# EAGLE design familab_pov (EAGLE 7.1.0)
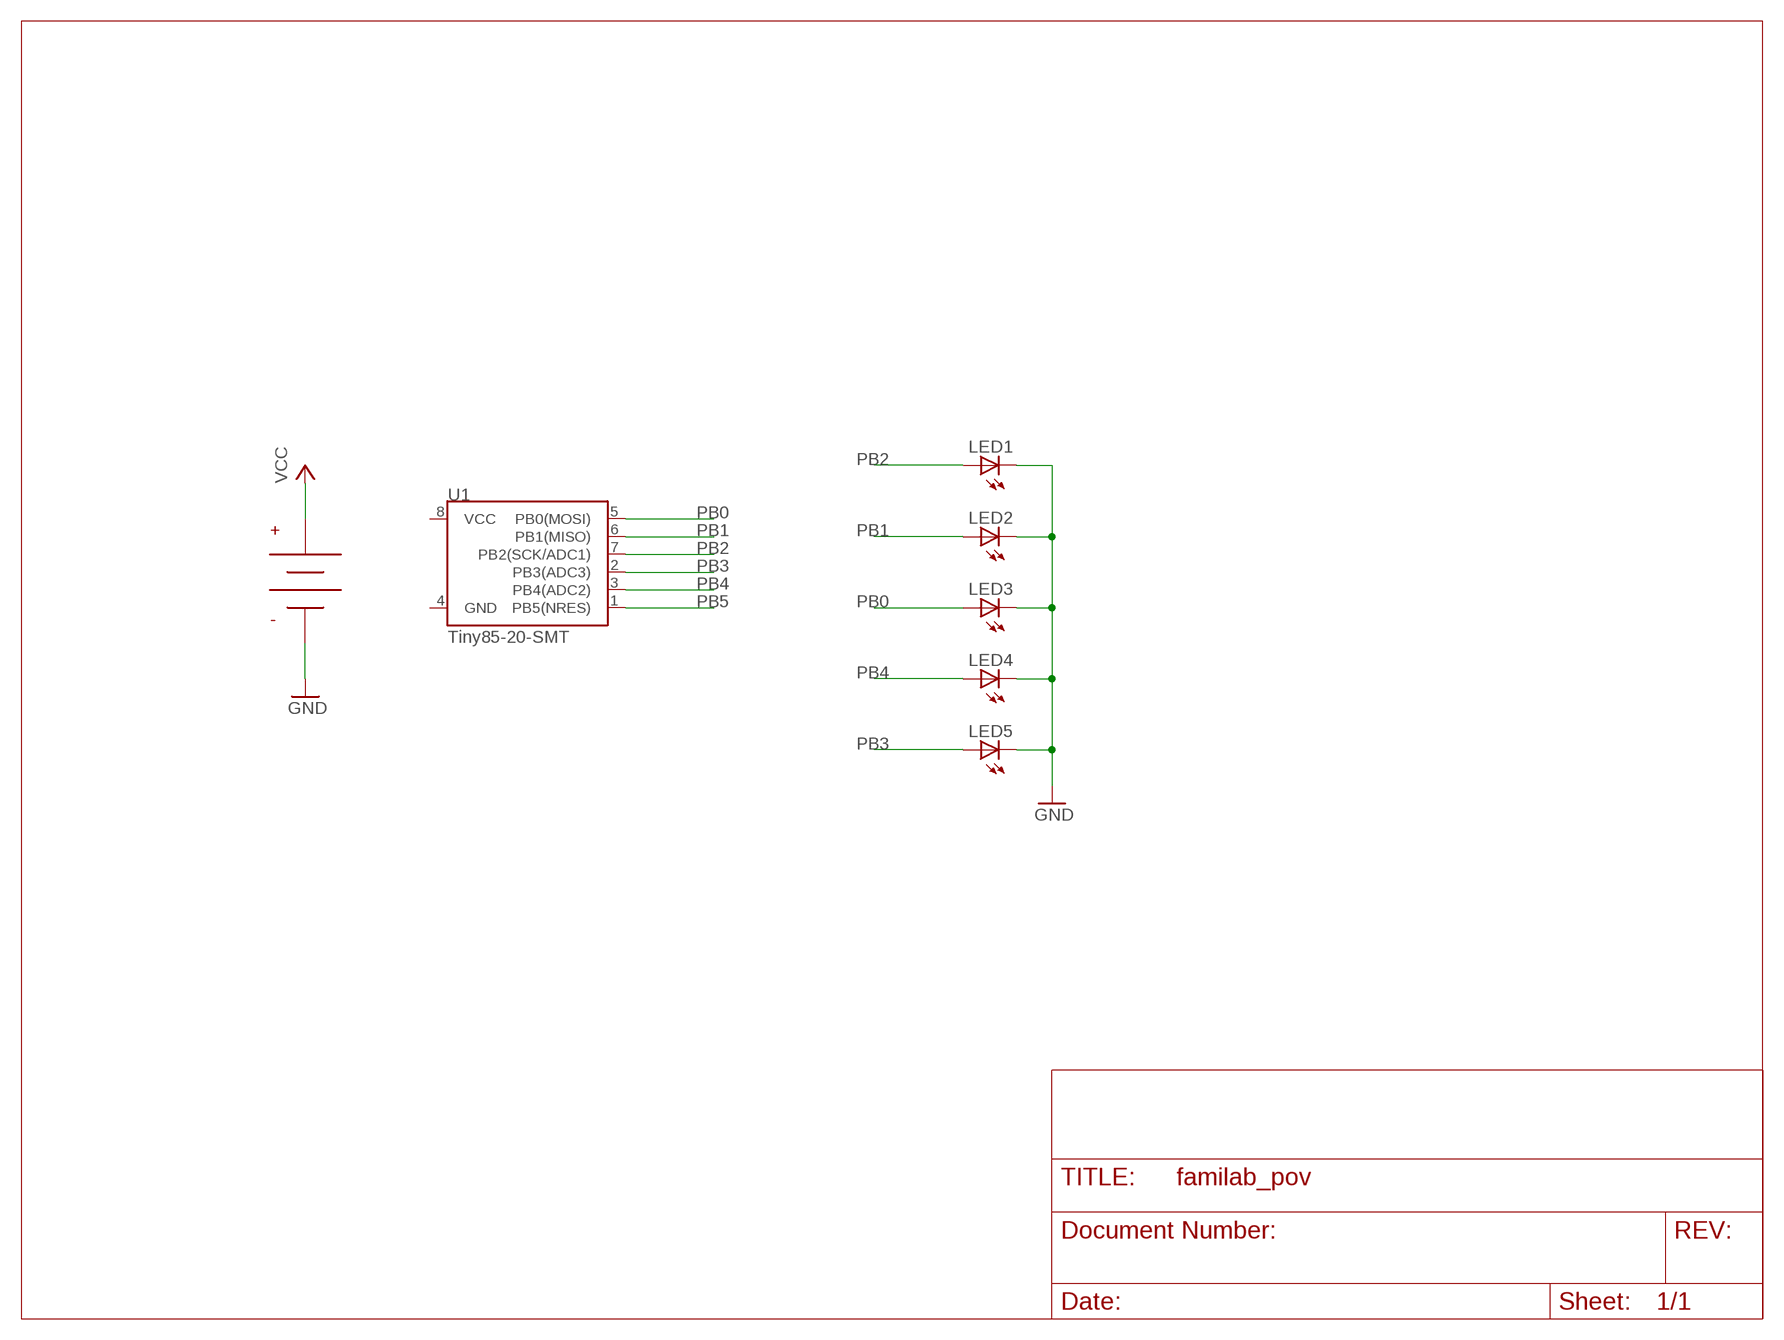
[diagram p0: schematic, sheet 1]

## Parts
LED1  LED  [LED5MM_SMD_SIDE]
LED2  LED  [LED5MM_SMD_SIDE]
LED3  LED  [LED5MM_SMD_SIDE]
LED4  LED  [LED5MM_SMD_SIDE]
LED5  LED  [LED5MM_SMD_SIDE]
U1  Tiny85-20-SMT  ATTINY45TINY85-20-SMT  [SO08-EIAJ]
U$1  CR2032_HOLDER  [CR2032_BC2032-F1]

## Nets
GND: LED1.C LED2.C LED3.C LED4.C LED5.C U$1.NEG
PB0: LED3.A U1.5(PB0(MOSI))
PB1: LED2.A U1.6(PB1(MISO))
PB2: LED1.A U1.7(PB2(SCK/ADC1))
PB3: LED5.A U1.2(PB3(ADC3))
PB4: LED4.A U1.3(PB4(ADC2))
PB5: U1.1(PB5(NRES))
VCC: U$1.POS
Unconnected: U1.4(GND) U1.8(VCC)

## Library data of the parts
LED1-LED5 = led:LED: LED OSRAM: - CHIPLED LG R971, LG N971, LY N971, LG Q971, LY Q971, LO R971, LY R971 LH N974, LH R974 LS Q976, LO Q976, LY Q976 LO Q996 - Hyper CHIPLED LW Q18S LB Q993, LB Q99A, LB R99A - SideLED LS A670, LO A670, LY A670, LG A670, LP A670 LB A673, LV A673, LT A673, LW A673 LH A674 LY A675 LS A676, LA A676, LO A676, LY A676, LW A676 LS A679, LY A679, LG A679 - Hyper Micro SIDELED® LS Y876, LA Y876, LO Y876, LY Y876 LT Y87S - SmartLED LW L88C, LW L88S LB L89C, LB L89S, LG L890 LS L89K, LO L89K, LY L89K LS L896, LA L896, LO L896, LY L896 - TOPLED LS T670, LO T670, LY T670, LG T670, LP T670 LSG T670, LSP T670, LSY T670, LOP T670, LYG T670 LG T671, LOG T671, LSG T671 LB T673, LV T673, LT T673, LW T673 LH T674 LS T676, LA T676, LO T676, LY T676, LB T676, LH T676, LSB T676, LW T676 LB T67C, LV T67C, LT T67C, LS T67K, LO T67K, LY T67K, LW E67C LS E67B, LA E67B, LO E67B, LY E67B, LB E67C, LV E67C, LT E67C LW T67C LS T679, LY T679, LG T679 LS T770, LO T770, LY T770, LG T770, LP T770 LB T773, LV T773, LT T773, LW T773 LH T774 LS E675, LA E675, LY E675, LS T675 LS T776, LA T776, LO T776, LY T776, LB T776 LHGB T686 LT T68C, LB T68C - Hyper Mini TOPLED® LB M676 - Mini TOPLED Santana® LG M470 LS M47K, LO M47K, LY M47K Source: http://www.osram.convergy.de LUXEON: - LUMILED® LXK2-PW12-R00, LXK2-PW12-S00, LXK2-PW14-U00, LXK2-PW14-V00 LXK2-PM12-R00, LXK2-PM12-S00, LXK2-PM14-U00 LXK2-PE12-Q00, LXK2-PE12-R00, LXK2-PE12-S00, LXK2-PE14-T00, LXK2-PE14-U00 LXK2-PB12-K00, LXK2-PB12-L00, LXK2-PB12-M00, LXK2-PB14-N00, LXK2-PB14-P00, LXK2-PB14-Q00 LXK2-PR12-L00, LXK2-PR12-M00, LXK2-PR14-Q00, LXK2-PR14-R00 LXK2-PD12-Q00, LXK2-PD12-R00, LXK2-PD12-S00 LXK2-PH12-R00, LXK2-PH12-S00 LXK2-PL12-P00, LXK2-PL12-Q00, LXK2-PL12-R00 Source: www.luxeon.com KINGBRIGHT: KA-3528ASYC Source: www.kingbright.com
U1 = SparkFun-DigitalIC:ATTINY45: Atmel 8-pin 2/4/8kB flash uC; PROD_ID: IC-09092
U$1 = pov_class:CR2032_HOLDER

## Board
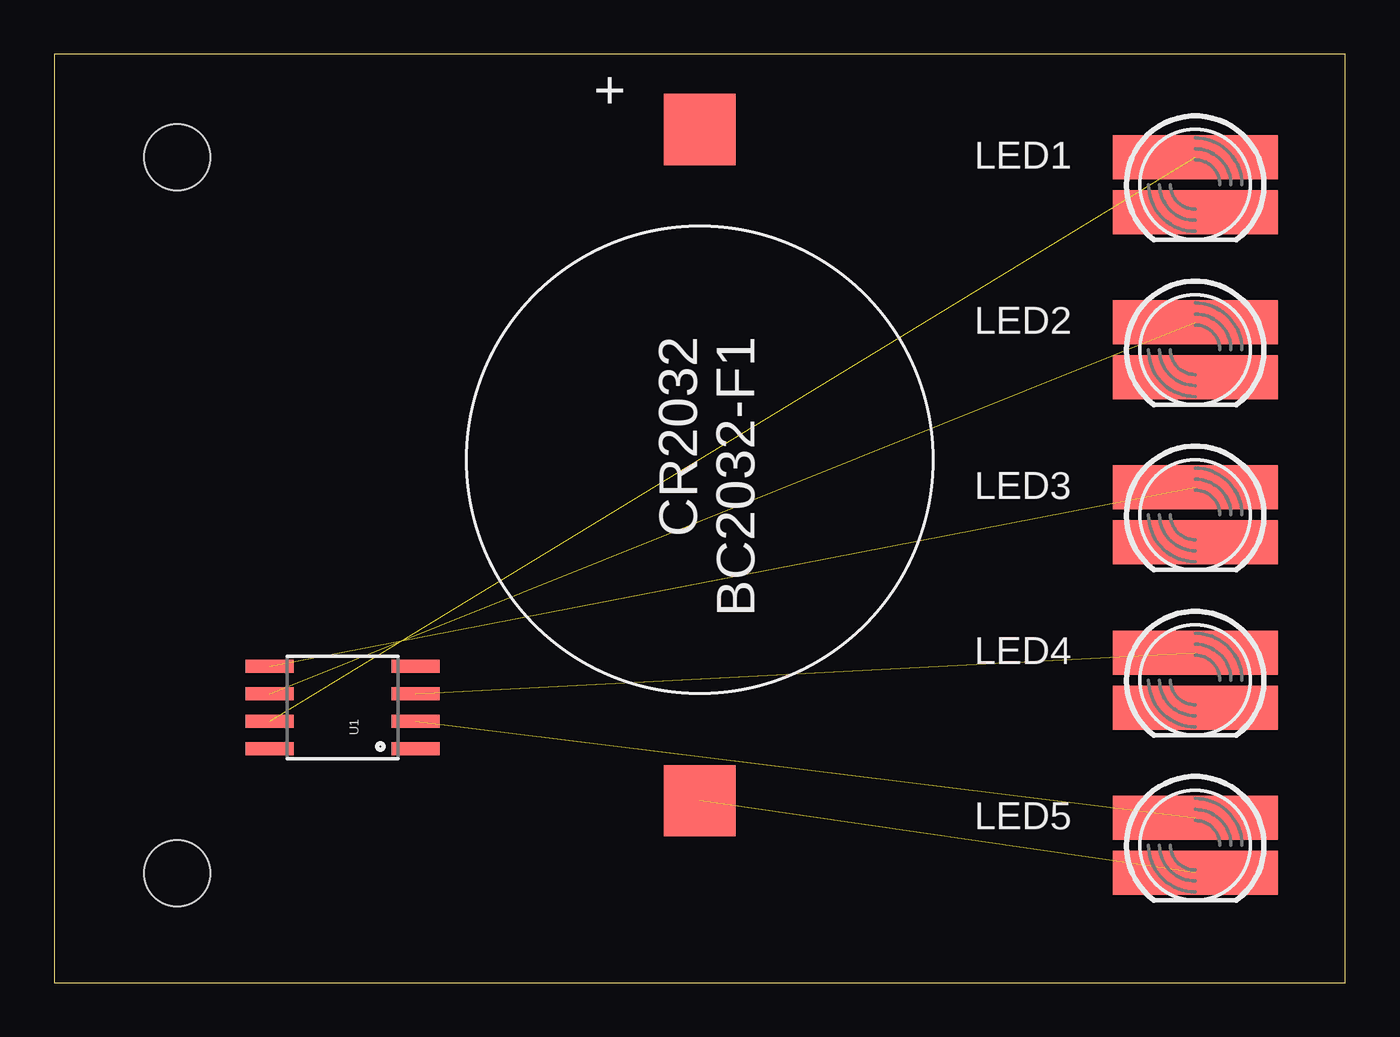
[diagram p1: board, top side]
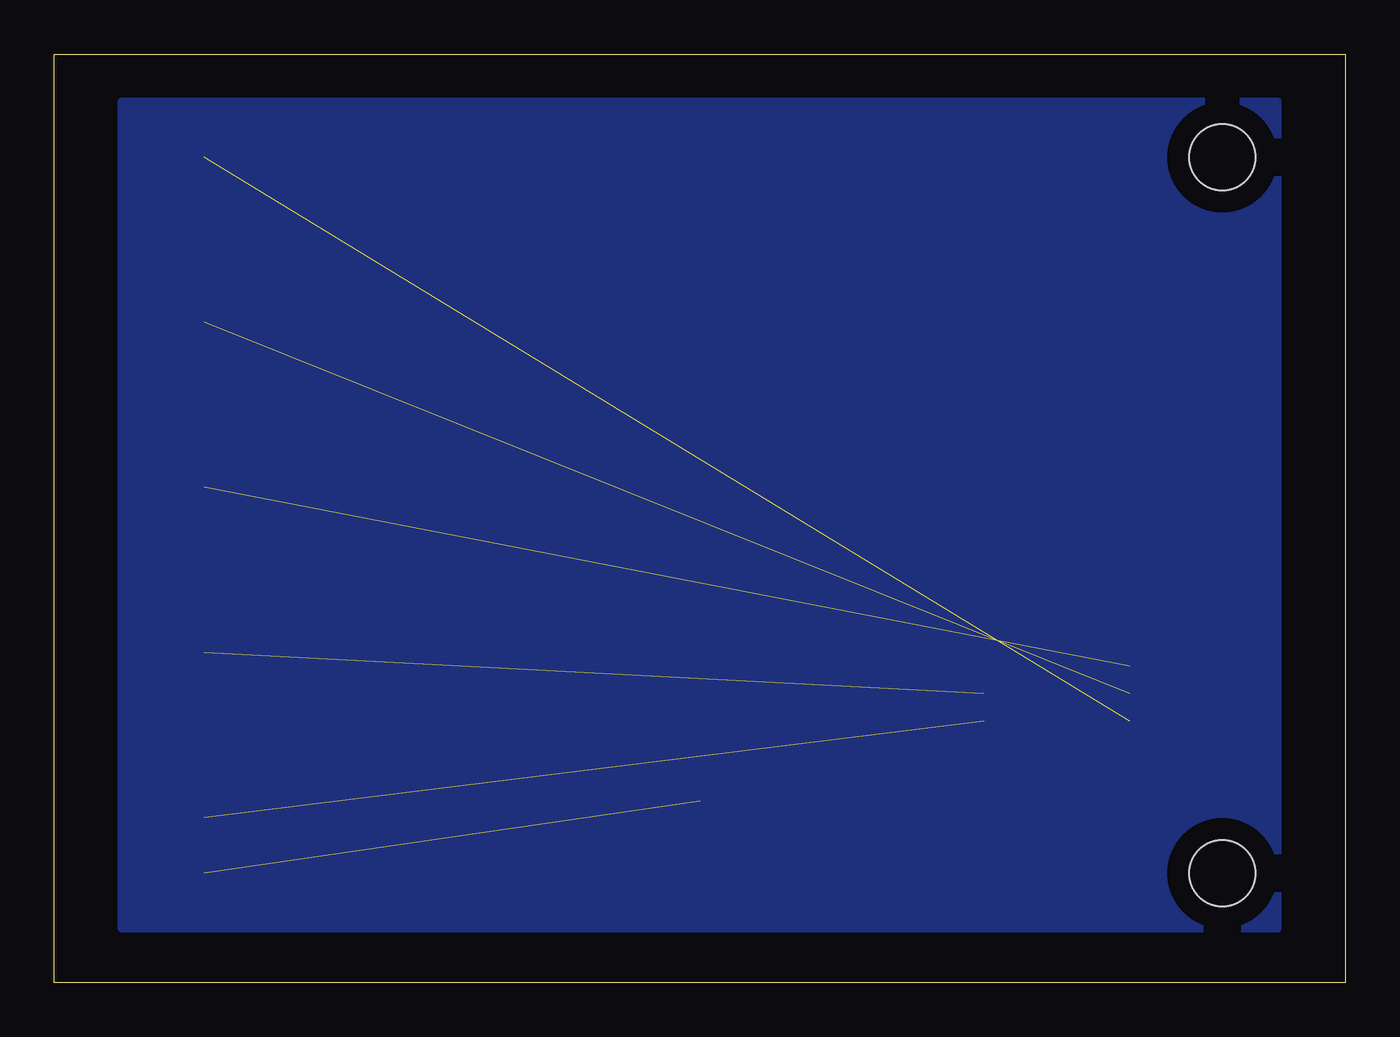
[diagram p2: board, bottom side, seen from below]

Size 59.6 x 42.85 mm. Coordinates in mm from the lower left corner, seen from the top.
Outline: 0,0 59.6,0 59.6,42.85 0,42.85 0,0
Copper layers (1*16): Top 0.035mm / dielectric 1.5mm / Bottom 0.035mm
Design rules "default": minimum track width 10mil, minimum drill 24mil, track to track 8mil, track to pad 8mil, pad to pad 8mil, via to via 8mil, smd to smd 8mil, copper to edge 40mil, drill to drill 8mil, minimum pad ring 10mil, minimum via ring 8mil, stop-mask expansion 4mil, vias tented up to drill 0mil, thermal gap 10mil
Holes 3.05 mm at 5.68,5.05 5.68,38.1

### Footprints (pad centres in the part's own frame; a part is rotated, then mirrored left to right if it is on the bottom)
LED5MM_SMD_SIDE = smd 2.032 x 7.62: A -1.27,0; C 1.27,0
SO08-EIAJ = smd 0.61 x 2.21: 1 -1.905,-3.378; 2 -0.635,-3.378; 3 0.635,-3.378; 4 1.905,-3.378; 5 1.905,3.353; 6 0.635,3.353; 7 -0.635,3.353; 8 -1.905,3.353
CR2032_BC2032-F1 = smd 3.29 x 3.29: NEG 30.97,0; POS 0,0

### Placement (x,y rotation side)
LED1  52.67,36.83 270 top
LED2  52.67,29.21 270 top
LED3  52.67,21.59 270 top
LED4  52.67,13.97 270 top
LED5  52.67,6.35 270 top
U1  13.3,12.7 90 top
U$1  29.8,39.37 270 top

### Tracks (layer width: path | path; a pad name or v marks a point on that pad's centre or on a via)
GND  (1 unrouted)
  pour Bottom: 3.14,40.64 56.48,40.64 56.48,2.54 3.14,2.54
PB0  (1 unrouted)
PB1  (1 unrouted)
PB2  (1 unrouted)
PB3  (1 unrouted)
PB4  (1 unrouted)